# Altium schematic sheet Teensy_Interface.SchDoc
size A4; SheetNumber: 1; SheetTotal: 4
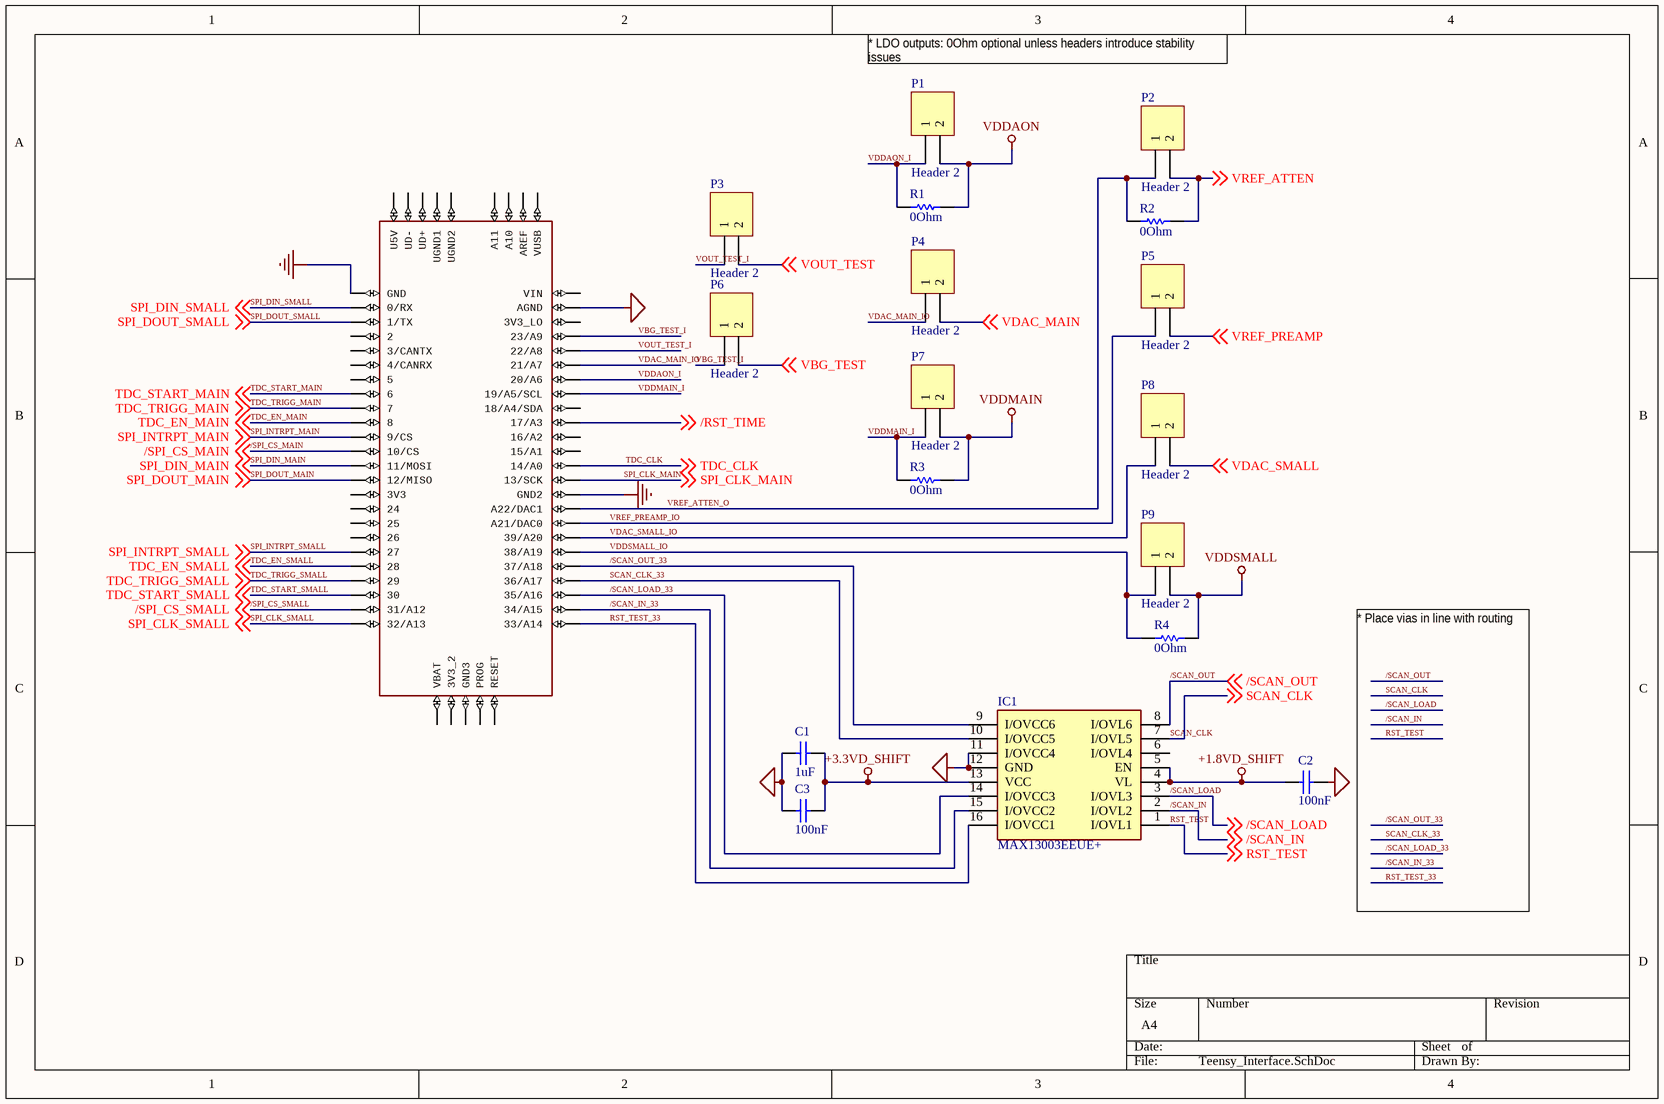
[diagram p0: Teensy_Interface.SchDoc]

## Parts
C1  1uF  [CAPC1608X90X35ML10T15]
C2  100nF  [CAPC1608X90X35ML10T15]
C3  100nF  [CAPC1608X90X35ML10T15]
IC1  MAX13003EEUE+  [SOP65P640X110-16N]
P1  Header 2  [HDR1X2]
P2  Header 2  [HDR1X2]
P3  Header 2  [HDR1X2]
P4  Header 2  [HDR1X2]
P5  Header 2  [HDR1X2]
P6  Header 2  [HDR1X2]
P7  Header 2  [HDR1X2]
P8  Header 2  [HDR1X2]
P9  Header 2  [HDR1X2]
R1  0Ohm  [RESC1609X50X30NL8T20]
R2  0Ohm  [RESC1609X50X30NL8T20]
R3  0Ohm  [RESC1609X50X30NL8T20]
R4  0Ohm  [RESC1609X50X30NL8T20]
TEENSY1  TEENSY_3.5/3.6  [TEENSY_3.5/3.6]  (value not drawn)

## Nets
+1.8VD_SHIFT: C2.1 IC1.4(VL) IC1.5(EN)
+3.3VD_SHIFT: C1.2 C3.2 IC1.13(VCC)
GND: C1.1 C2.2 C3.1 IC1.11(I/OVCC4) IC1.12(GND) TEENSY1.AGND TEENSY1.GND TEENSY1.GND2
VDDAON: P1.2 R1.2
VDDMAIN: P7.2 R3.2
VDDSMALL: P9.2 R4.2
 TDC_CLK: TEENSY1.14/A0 ; off-sheet TDC_CLK  [also labelled TDC_CLK]
/RST_TIME: TEENSY1.17/A3 ; off-sheet /RST_TIME
/SCAN_IN: IC1.2(I/OVL2) ; off-sheet /SCAN_IN
/SCAN_IN_33: IC1.15(I/OVCC2) TEENSY1.34/A15
/SCAN_LOAD: IC1.3(I/OVL3) ; off-sheet /SCAN_LOAD
/SCAN_LOAD_33: IC1.14(I/OVCC3) TEENSY1.35/A16
/SCAN_OUT: IC1.8(I/OVL6) ; off-sheet /SCAN_OUT
/SCAN_OUT_33: IC1.9(I/OVCC6) TEENSY1.37/A18
/SPI_CS_MAIN: TEENSY1.10/CS ; off-sheet /SPI_CS_MAIN
/SPI_CS_SMALL: TEENSY1.31/A12 ; off-sheet /SPI_CS_SMALL
RST_TEST: IC1.1(I/OVL1) ; off-sheet RST_TEST
RST_TEST_33: IC1.16(I/OVCC1) TEENSY1.33/A14
SCAN_CLK: IC1.7(I/OVL5) ; off-sheet SCAN_CLK
SCAN_CLK_33: IC1.10(I/OVCC5) TEENSY1.36/A17
SPI_CLK_MAIN: TEENSY1.13/SCK ; off-sheet SPI_CLK_MAIN
SPI_CLK_SMALL: TEENSY1.32/A13 ; off-sheet SPI_CLK_SMALL
SPI_DIN_MAIN: TEENSY1.11/MOSI ; off-sheet SPI_DIN_MAIN
SPI_DIN_SMALL: TEENSY1.0/RX ; off-sheet SPI_DIN_SMALL
SPI_DOUT_MAIN: TEENSY1.12/MISO ; off-sheet SPI_DOUT_MAIN
SPI_DOUT_SMALL: TEENSY1.1/TX ; off-sheet SPI_DOUT_SMALL
SPI_INTRPT_MAIN: TEENSY1.9/CS ; off-sheet SPI_INTRPT_MAIN
SPI_INTRPT_SMALL: TEENSY1.27 ; off-sheet SPI_INTRPT_SMALL
TDC_EN_MAIN: TEENSY1.8 ; off-sheet TDC_EN_MAIN
TDC_EN_SMALL: TEENSY1.28 ; off-sheet TDC_EN_SMALL
TDC_START_MAIN: TEENSY1.6 ; off-sheet TDC_START_MAIN
TDC_START_SMALL: TEENSY1.30 ; off-sheet TDC_START_SMALL
TDC_TRIGG_MAIN: TEENSY1.7 ; off-sheet TDC_TRIGG_MAIN
TDC_TRIGG_SMALL: TEENSY1.29 ; off-sheet TDC_TRIGG_SMALL
VBG_TEST: P6.2 ; off-sheet VBG_TEST
VBG_TEST_I: P6.1 TEENSY1.23/A9
VDAC_MAIN: P4.2 ; off-sheet VDAC_MAIN
VDAC_MAIN_IO: P4.1 TEENSY1.21/A7
VDAC_SMALL: P8.2 ; off-sheet VDAC_SMALL
VDAC_SMALL_IO: P8.1 TEENSY1.39/A20
VDDAON_I: P1.1 R1.1 TEENSY1.20/A6
VDDMAIN_I: P7.1 R3.1 TEENSY1.19/A5/SCL
VDDSMALL_IO: P9.1 R4.1 TEENSY1.38/A19
VOUT_TEST: P3.2 ; off-sheet VOUT_TEST
VOUT_TEST_I: P3.1 TEENSY1.22/A8
VREF_ATTEN: P2.2 R2.2 ; off-sheet VREF_ATTEN
VREF_ATTEN_O: P2.1 R2.1 TEENSY1.A22/DAC1
VREF_PREAMP: P5.2 ; off-sheet VREF_PREAMP
VREF_PREAMP_IO: P5.1 TEENSY1.21/DAC0(A21/DAC0)

Not connected (* = marked no-connect by the designer): IC1 6(I/OVL4); TEENSY1 2 3/CANTX 3V3 3V3_2 3V3_LO 4/CANRX 5 15/A1 16/A2 18/A4/SDA 24 25 26 A10 A11 AREF GND3 PROG RESET U5V UD+ UD- UGND1 UGND2 VBAT VIN VUSB

## Notes on the sheet
- * LDO outputs: 0Ohm optional unless headers introduce stability issues
- (near C2) * Place vias in line with routing

## Library data of the parts
C1-C3 = CMP-2000-04945-1: 0603; Manufacturer: Murata; Capacitance: 22pF; Tolerance (%): ±5%; Rated Voltage: 50V; Dielectric: C0G; Manufacturer URL: http://www.murata.com/; Datasheet Version: Jul-06; Package Reference: 603; Case Size/Dimension: 0603; Package Description: 2-Pin Surface Mount Device, Body 1.6 x 0.8 mm; Datasheet URL: https://datasheet.ciiva.com/11786/0900766b807a1cab-11786398.pdf
IC1 = MAX13003EEUE+: Integrated Circuit; Manufacturer_Name: Maxim Integrated; Datasheet Link: https://pdfserv.maximintegrated.com/en/ds/MAX13000E-MAX13005E.pdf; Height: 1.1mm; Manufacturer_Part_Number: MAX13003EEUE+
P1-P9 = Header 2: Header, 2-Pin; LatestRevisionDate: 17-Jul-2002; LatestRevisionNote: Re-released for DXP Platform.; Publisher: Altium Limited
R1-R4 = CMP-2000-03816-5: Chip Resistor, 0 Ohm, Jumper, 100 mW, -55 to 155 degC, 0603 (1608 Metric), RoHS, Tape and Reel; Manufacturer: Vishay Semiconductor; Voltage Rating: 75 V; Package Quantity: 5000; DatasheetVersion: 06/2012; Min Operating Temperature: -55 degC; ComponentLink1URL: http://www.vishay.com/; Mounting Technology: Surface Mount; Height: 0.45 mm; ComponentLink1Description: Manufacturer URL; REACH SVHC: Unknown; PackageReference: 0603; Packaging: Tape and Reel; Max Operating Temperature: 155 degC; Mount: Surface Mount; ComponentLink2Description: Datasheet; PackageDescription: 2-Pin Surface Mount Device, Body 1.575 x 0.85 mm; Length: 1.55 mm; ComponentLink2URL: http://www.vishay.com/docs/20035/dcrcwe3.pdf; Pins: 2; RoHSCompliant: true
TEENSY1 = TEENSY_3.5/3.6: GateName_1: G$1; SymbolName_1: TEENSY_3.5/3.6; LibraryName: Teensy356; DeviceSetName: TEENSY_3.5/3.6; Package: TEENSY_3.5/3.6